# EAGLE schematic CC2530_PCB_Updated_Antenna+Stim+EMG (EAGLE 7.1.0)
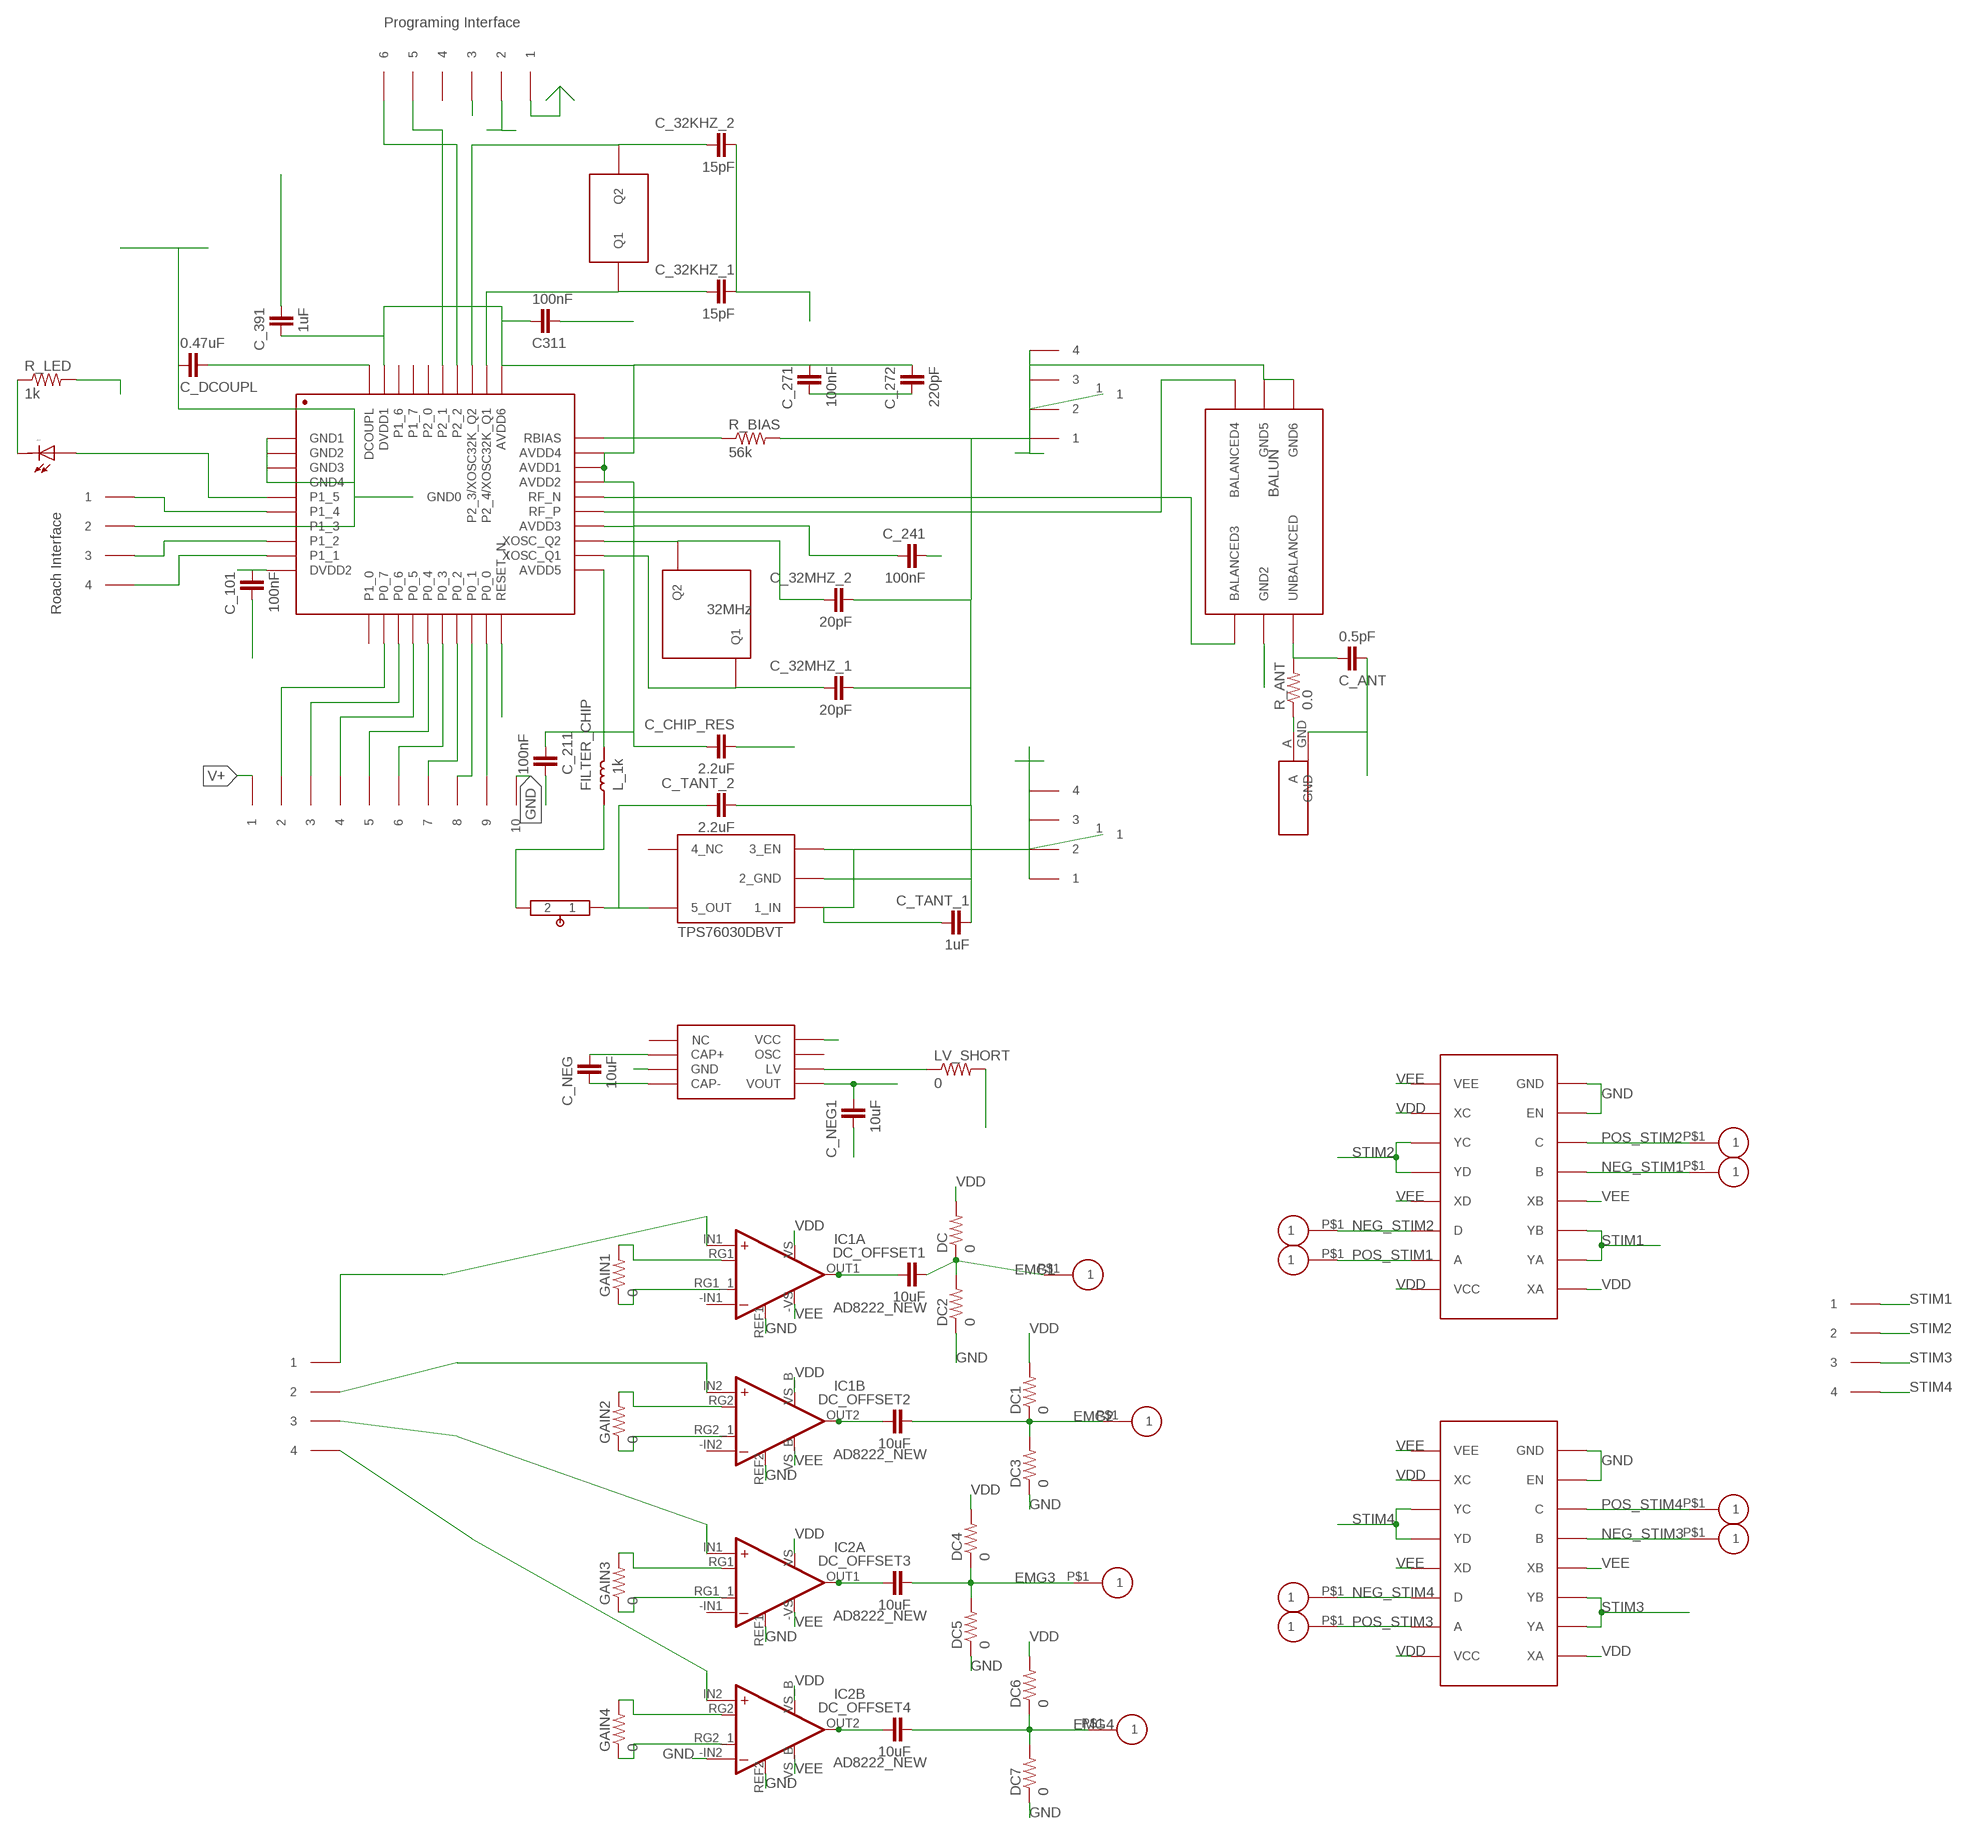
[diagram p0: schematic, sheet 1]

## Parts
32KHZ  X32.768KHZ  [X32.768KHZ]
C311  100nF  0Y0X_C0201  [0201_R/L/C]
C_32KHZ_1  15pF  0Y0X_C0201  [0201_R/L/C]
C_32KHZ_2  15pF  0Y0X_C0201  [0201_R/L/C]
C_32MHZ_1  20pF  0Y0X_C0201  [0201_R/L/C]
C_32MHZ_2  20pF  0Y0X_C0201  [0201_R/L/C]
C_101  100nF  0Y0X_C0201  [0201_R/L/C]
C_211  100nF  0Y0X_C0201  [0201_R/L/C]
C_241  100nF  0Y0X_C0201  [0201_R/L/C]
C_271  100nF  0Y0X_C0201  [0201_R/L/C]
C_272  220pF  0Y0X_C0201  [0201_R/L/C]
C_391  1uF  0Y0X_C0201  [0201_R/L/C]
C_ANT  0.5pF  0Y0X_C0201  [0201_R/L/C]
C_CHIP_RES  2.2uF  0Y0X_C0402  [0402_R/L/C]
C_DCOUPL  0.47uF  0Y0X_C0201  [0201_R/L/C]
C_NEG  10uF  0Y0X_C0402  [0402_R/L/C]
C_NEG1  10uF  0Y0X_C0402  [0402_R/L/C]
C_TANT_1  1uF  0Y0X_C0603  [0603_R/L/C]
C_TANT_2  2.2uF  0Y0X_C0603  [0603_R/L/C]
DC  0  0Y0X_R0402  [0402_R/L/C]
DC1  0  0Y0X_R0402  [0402_R/L/C]
DC2  0  0Y0X_R0402  [0402_R/L/C]
DC3  0  0Y0X_R0402  [0402_R/L/C]
DC4  0  0Y0X_R0402  [0402_R/L/C]
DC5  0  0Y0X_R0402  [0402_R/L/C]
DC6  0  0Y0X_R0402  [0402_R/L/C]
DC7  0  0Y0X_R0402  [0402_R/L/C]
DC_OFFSET1  10uF  0Y0X_C0402  [0402_R/L/C]
DC_OFFSET2  10uF  0Y0X_C0402  [0402_R/L/C]
DC_OFFSET3  10uF  0Y0X_C0402  [0402_R/L/C]
DC_OFFSET4  10uF  0Y0X_C0402  [0402_R/L/C]
EMG1  DBG_ELECTRODE  [DBG_ELECTRODE]
FILTER_CHIP  L_1k  0Y0X_L0402  [0402_R/L/C]
GAIN1  0  0Y0X_R0402  [0402_R/L/C]
GAIN2  0  0Y0X_R0402  [0402_R/L/C]
GAIN3  0  0Y0X_R0402  [0402_R/L/C]
GAIN4  0  0Y0X_R0402  [0402_R/L/C]
GND_IN  FFC4POS  [FFC4POS]
IC1  AD8222_NEW  [QFN-16]
IC2  AD8222_NEW  [QFN-16]
INVERTED_F-ANTENNA  ANTENNA  [ANTENNA]
LED  LED0603  [0603_R/L/C]
LV_SHORT  0  0Y0X_R0402  [0402_R/L/C]
R_ANT  0.0  0Y0X_R0201  [0201_R/L/C]
R_BIAS  56k  0Y0X_R0201  [0201_R/L/C]
R_LED  1k  0Y0X_R0402  [0402_R/L/C]
U$1  CC2530  [CC2530]
U$2  BALUN  [BALUN]
U$3  X32MHZ  [X32MHZ]
U$4  TL7660  [S-PDSO-G8]
U$5  MC74HC4316A  [SOIC-16-ON-SEMI]
U$6  MC74HC4316A  [SOIC-16-ON-SEMI]
U$9  DBG_ELECTRODE  [DBG_ELECTRODE]
U$10  REGULATOR  [REGULATOR]
U$11  DBG_ELECTRODE  [DBG_ELECTRODE]
U$12  DBG_ELECTRODE  [DBG_ELECTRODE]
U$13  FFC4POS  [FFC4POS]
U$14  DBG_ELECTRODE  [DBG_ELECTRODE]
U$15  FFC10POS  [FFC10POS]
U$16  DBG_ELECTRODE  [DBG_ELECTRODE]
U$17  FFC6POS  [FFC6POS]
U$18  SWITCH_MANUAL  [SWITCH_MANUAL]
U$19  DBG_ELECTRODE  [DBG_ELECTRODE]
U$22  DBG_ELECTRODE  [DBG_ELECTRODE]
U$23  DBG_ELECTRODE  [DBG_ELECTRODE]
U$24  FFC4POS  [FFC4POS]
U$25  DBG_ELECTRODE  [DBG_ELECTRODE]
U$26  DBG_ELECTRODE  [DBG_ELECTRODE]
U$27  DBG_ELECTRODE  [DBG_ELECTRODE]
U$28  FFC4POS  [FFC4POS]
V+_IN  FFC4POS  [FFC4POS]
WIRE+  DRILL_CONNECT  [DRILL_CONNECT]
WIRE-  DRILL_CONNECT  [DRILL_CONNECT]

## Nets
DCOUPL1: C_DCOUPL.1 U$1.DCOUPL
EMG1: DC2.2 DC.1 DC_OFFSET1.2 EMG1.P$1
EMG2: DC1.1 DC3.2 DC_OFFSET2.2 U$25.P$1
EMG3: DC4.1 DC5.2 DC_OFFSET3.2 U$26.P$1
EMG4: DC6.1 DC7.2 DC_OFFSET4.2 U$27.P$1
GND: C311.1 C_32KHZ_1.2 C_32KHZ_2.2 C_32MHZ_1.2 C_32MHZ_2.2 C_101.1 C_211.2 C_241.2 C_271.1 C_272.1 C_391.2 C_ANT.1 C_CHIP_RES.2 C_DCOUPL.2 C_NEG1.1 C_TANT_1.2 C_TANT_2.2 DC2.1 DC3.1 DC5.1 DC7.1 GND_IN.1 GND_IN.2 GND_IN.3 GND_IN.4 IC1.REF1(A:REF) IC1.REF2(B:REF) IC2.-IN2(B:-IN) IC2.REF1(A:REF) IC2.REF2(B:REF) INVERTED_F-ANTENNA.GND LV_SHORT.2 R_BIAS.2 R_LED.2 U$1.GND0 U$1.GND1 U$1.GND001(GND0) U$1.GND2 U$1.GND002(GND0) U$1.GND3 U$1.GND003(GND0) U$1.GND4 U$1.GND004(GND0) U$1.GND005(GND0) U$1.GND006(GND0) U$1.GND007(GND0) U$1.GND008(GND0) U$1.GND009(GND0) U$1.GND010(GND0) U$1.GND011(GND0) U$1.GND012(GND0) U$1.GND013(GND0) U$1.GND014(GND0) U$1.GND015(GND0) U$1.GND016(GND0) U$1.P1_3 U$2.GND2 U$2.GND5 U$2.GND6 U$4.3(GND) U$5.7(EN) U$5.8(GND) U$6.7(EN) U$6.8(GND) U$10.2(2_GND) U$13.2 U$15.10 U$17.2 WIRE-.1
LED/P1_5: LED.1(A) U$1.P1_5
LT/P1_4: U$1.P1_4 U$13.1
N$1: C_ANT.2 R_ANT.2 U$2.UNBALANCED
N$2: INVERTED_F-ANTENNA.A R_ANT.1
N$3: C_NEG.2 U$4.2(CAP+)
N$4: C_NEG.1 U$4.4(CAP-)
N$5: LV_SHORT.1 U$4.6(LV)
N$6: GAIN1.2 IC1.RG1(A:RG1)
N$7: GAIN1.1 IC1.RG1_1(A:RG1_1)
N$8: GAIN2.2 IC1.RG2(B:RG1)
N$9: GAIN2.1 IC1.RG2_1(B:RG1_1)
N$10: GAIN3.2 IC2.RG1(A:RG1)
N$11: GAIN3.1 IC2.RG1_1(A:RG1_1)
N$12: GAIN4.2 IC2.RG2(B:RG1)
N$13: GAIN4.1 IC2.RG2_1(B:RG1_1)
N$14: DC_OFFSET1.1 IC1.OUT1(A:OUT)
N$15: DC_OFFSET2.1 IC1.OUT2(B:OUT)
N$16: DC_OFFSET4.1 IC2.OUT2(B:OUT)
N$17: DC_OFFSET3.1 IC2.OUT1(A:OUT)
N$18: IC2.IN2(B:+IN) U$24.4
N$19: IC2.IN1(A:+IN) U$24.3
N$20: IC1.IN2(B:+IN) U$24.2
N$21: C_TANT_2.1 U$10.5(5_OUT) U$18.1
N$22: IC1.IN1(A:+IN) U$24.1
N$34: LED.2(C) R_LED.1
NEG_STIM1: U$5.5(B) U$14.P$1
NEG_STIM2: U$5.14(D) U$9.P$1
NEG_STIM3: U$6.5(B) U$19.P$1
NEG_STIM4: U$6.14(D) U$22.P$1
P0_0: U$1.P0_0 U$15.9
P0_1: U$1.P0_1 U$15.8
P0_2: U$1.P0_2 U$15.7
P0_3: U$1.P0_3 U$15.6
P0_4: U$1.P0_4 U$15.5
P0_5: U$1.P0_5 U$15.4
P0_6: U$1.P0_6 U$15.3
P0_7: U$1.P0_7 U$15.2
P2_1: U$1.P2_1 U$17.5
P2_2: U$1.P2_2 U$17.6
P2_3/X32K_Q2: 32KHZ.Q2 C_32KHZ_2.1 U$1.P2_3/XOSC32K_Q2
P2_4/X32K_Q1: 32KHZ.Q1 C_32KHZ_1.1 U$1.P2_4/XOSC32K_Q1
POS_STIM1: U$5.15(A) U$11.P$1
POS_STIM2: U$5.6(C) U$12.P$1
POS_STIM3: U$6.15(A) U$23.P$1
POS_STIM4: U$6.6(C) U$16.P$1
RBIAS: R_BIAS.1 U$1.RBIAS
RESET: U$1.RESET_N U$17.3
RF_N: U$1.RF_N U$2.BALANCED3
RF_P: U$1.RF_P U$2.BALANCED4
RT/P1_2: U$1.P1_2 U$13.3
STIM1: U$5.2(YA) U$5.3(YB) U$28.1
STIM2: U$5.11(YC) U$5.12(YD) U$28.2
STIM3: U$6.2(YA) U$6.3(YB) U$28.3
STIM4: U$6.11(YC) U$6.12(YD) U$28.4
SWITCH_OUT: FILTER_CHIP.1 U$18.2
UP/P1_1: U$1.P1_1 U$13.4
V+: C_TANT_1.1 U$10.1(1_IN) U$10.3(3_EN) U$15.1 V+_IN.1 V+_IN.2 V+_IN.3 V+_IN.4 WIRE+.1
VDD: C311.2 C_101.2 C_211.1 C_241.1 C_271.2 C_272.2 C_391.1 C_CHIP_RES.1 DC1.2 DC4.2 DC6.2 DC.2 FILTER_CHIP.2 IC1.VS(A:V+) IC1.VS_B(B:V+) IC2.VS(A:V+) IC2.VS_B(B:V+) U$1.AVDD1 U$1.AVDD2 U$1.AVDD3 U$1.AVDD4 U$1.AVDD5 U$1.AVDD6 U$1.DVDD1 U$1.DVDD2 U$4.8(VCC) U$5.1(XA) U$5.10(XC) U$5.16(VCC) U$6.1(XA) U$6.10(XC) U$6.16(VCC) U$17.1
VEE: C_NEG1.2 IC1.-VS(A:V-) IC1.-VS_B(B:V-) IC2.-VS(A:V-) IC2.-VS_B(B:V-) U$4.5(VOUT) U$5.4(XB) U$5.9(VEE) U$5.13(XD) U$6.4(XB) U$6.9(VEE) U$6.13(XD)
X32M_Q1: C_32MHZ_1.1 U$1.XOSC_Q1 U$3.Q1
X32M_Q2: C_32MHZ_2.1 U$1.XOSC_Q2 U$3.Q2
Unconnected: IC1.-IN1(A:-IN) IC1.-IN2(B:-IN) IC2.-IN1(A:-IN) U$1.P1_0 U$1.P1_6 U$1.P1_7 U$1.P2_0 U$10.4(4_NC) U$17.4

## Notes on the sheet
- Programing Interface
- Roach Interface

## Power pins joined to a net without a drawn wire
NC: U$4.1(NC)
OSC: U$4.7(OSC)

## Library data of the parts
32KHZ = CC2530_PCB_TL:X32.768KHZ: X32.768kHz 9HT11-32.768KDZC-T
C311 C_32KHZ_1 C_32KHZ_2 C_32MHZ_1 C_32MHZ_2 C_101 C_211 C_241 C_271 C_272 C_391 C_ANT C_CHIP_RES C_DCOUPL C_NEG C_NEG1 C_TANT_1 C_TANT_2 DC_OFFSET1-DC_OFFSET4 = CC2530_PCB_TL:0Y0X_C
DC DC1-DC7 GAIN1-GAIN4 LV_SHORT R_ANT R_BIAS R_LED = CC2530_PCB_TL:0Y0X_R: Package / Case 0201 (0603 Metric)
EMG1 U$9 U$11 U$12 U$14 U$16 U$19 U$22 U$23 U$25-U$27 = moth:DBG_ELECTRODE
FILTER_CHIP = CC2530_PCB_TL:0Y0X_L
GND_IN U$13 U$24 U$28 V+_IN = CC2530_PCB_TL:FFC4POS: FFC COnnector 4POS
IC1 IC2 = moth:AD8222_NEW: OP AMP AD8222 Dual package instrumentation amplifier
INVERTED_F-ANTENNA = CC2530_PCB_TL:ANTENNA: Antenna
LED = CC2530_PCB_TL:LED
U$1 = CC2530_PCB_TL:CC2530: CC2530_QFN40
U$2 = CC2530_PCB_TL:BALUN: 2.45 GHz Impedance Matched Balun-BPF: For TI CC253X, CC254X, CC257X, CC853X and CC852X Chipset family P/N 2450BM15A0002
U$3 = CC2530_PCB_TL:X32MHZ: X32MHz ABM12-32.000MHZ-B2X-T3; X: 32MHz
U$4 = moth:TL7660
U$5 U$6 = moth:MC74HC4316A
U$10 = CC2530_PCB_TL:REGULATOR: IC REG LDO 3V 50MA SOT23-5 TPS76030DBVT
U$15 = CC2530_PCB_TL:FFC10POS: FFC Connector 10POS
U$17 = CC2530_PCB_TL:FFC6POS: FFC Connector 6POS
U$18 = CC2530_PCB_TL:SWITCH_MANUAL
WIRE+ WIRE- = CC2530_PCB_TL:DRILL_CONNECT